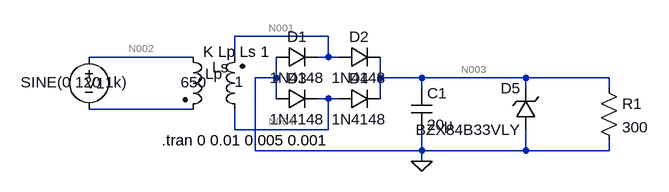
[diagram p0: schematic AC2DC.asc]
AC2DC.asc, the LTspice schematic file:
Version 4
SHEET 1 936 680
WIRE 352 112 208 112
WIRE 144 144 -16 144
WIRE 208 144 208 112
WIRE 352 144 352 112
WIRE 352 144 336 144
WIRE 368 144 352 144
WIRE 272 176 272 144
WIRE 272 176 240 176
WIRE 432 176 432 144
WIRE 496 176 432 176
WIRE 656 176 496 176
WIRE 784 176 656 176
WIRE 496 192 496 176
WIRE 656 192 656 176
WIRE 784 192 784 176
WIRE 272 208 272 176
WIRE 352 208 336 208
WIRE 368 208 352 208
WIRE 432 208 432 176
WIRE 144 224 -16 224
WIRE 208 256 208 224
WIRE 352 256 352 208
WIRE 352 256 208 256
WIRE 240 288 240 176
WIRE 496 288 496 256
WIRE 496 288 240 288
WIRE 656 288 656 256
WIRE 656 288 496 288
WIRE 784 288 784 272
WIRE 784 288 656 288
WIRE 496 304 496 288
FLAG 496 304 0
SYMBOL ind2 128 128 R0
WINDOW 0 35 42 Left 2
WINDOW 3 -3 55 Left 2
SYMATTR InstName Lp
SYMATTR Value 650
SYMATTR Type ind
SYMBOL ind2 224 240 R180
WINDOW 0 38 65 Top 2
WINDOW 3 2 58 Left 2
SYMATTR InstName Ls
SYMATTR Value 1
SYMATTR Type ind
SYMBOL voltage -16 128 R0
WINDOW 0 -5 56 Left 2
WINDOW 3 -105 55 Left 2
WINDOW 123 0 0 Left 0
SYMATTR InstName V1
SYMATTR Value SINE(0 120 1k)
SYMATTR SpiceLine Rser=0.0001
SYMBOL diode 272 160 R270
WINDOW 0 32 32 VTop 2
WINDOW 3 0 32 VBottom 2
SYMATTR InstName D1
SYMATTR Value 1N4148
SYMBOL diode 368 160 R270
WINDOW 0 32 32 VTop 2
WINDOW 3 0 32 VBottom 2
SYMATTR InstName D2
SYMATTR Value 1N4148
SYMBOL diode 272 224 R270
WINDOW 0 32 32 VTop 2
WINDOW 3 0 32 VBottom 2
SYMATTR InstName D3
SYMATTR Value 1N4148
SYMBOL diode 368 224 R270
WINDOW 0 32 32 VTop 2
WINDOW 3 0 32 VBottom 2
SYMATTR InstName D4
SYMATTR Value 1N4148
SYMBOL cap 480 192 R0
SYMATTR InstName C1
SYMATTR Value 20µ
SYMATTR SpiceLine V=630 Irms=0 Rser=0.0173 Lser=12.3n
SYMBOL res 768 176 R0
SYMATTR InstName R1
SYMATTR Value 300
SYMBOL zener 672 256 R180
WINDOW 0 24 64 Left 2
WINDOW 3 24 0 Left 2
SYMATTR InstName D5
SYMATTR Value BZX84B33VLY
SYMATTR Description Diode
SYMATTR Type diode
TEXT 160 136 Left 2 !K Lp Ls 1
TEXT 96 272 Left 2 !.tran 0 0.01 0.005 0.001

The netlist it stands for:
* AC2DC.asc
Lp N002 N005 650
Ls N004 N001 1
V1 N002 N005 SINE(0 120 1k) Rser=0.0001
D1 0 N001 1N4148
D2 N001 N003 1N4148
D3 0 N004 1N4148
D4 N004 N003 1N4148
C1 N003 0 20µ V=630 Irms=0 Rser=0.0173 Lser=12.3n
R1 N003 0 300
D5 0 N003 BZX84B33VLY
.model D D
.lib standard.dio
K Lp Ls 1
.tran 0 0.01 0.005 0.001
.backanno
.end

* Results of the author's LTspice run, read from the files saved beside the schematic
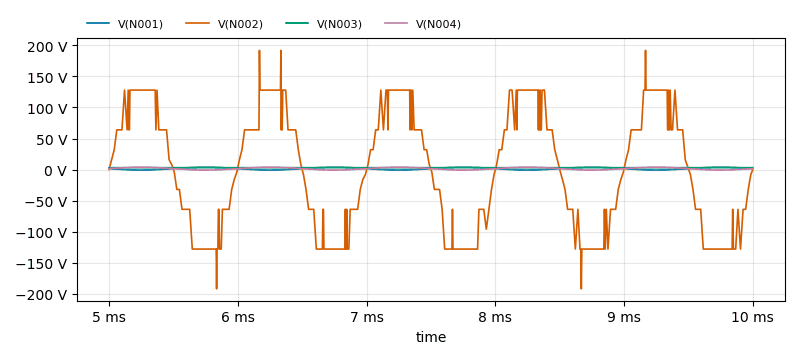
[diagram p1: Transient Analysis of AC2DC.asc, plotted from the saved traces]
* Transient Analysis, 1 run:
*   V(N001): min -817.8 mV, max 3.884 V, average 1.53 V, rms 2.26 V, last 1.529 V
*   V(N002): min -192 V, max 192 V, average -1.373 V, rms 97.1 V, last 0 V
*   V(N003): min 3.021 V, max 3.098 V, average 3.06 V, rms 3.06 V, last 3.058 V
*   V(N004): min -817.6 mV, max 3.884 V, average 1.53 V, rms 2.26 V, last 1.529 V